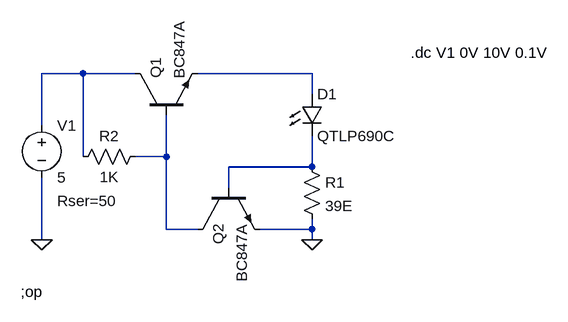
[diagram p0: schematic LEDdriver.asc]
LEDdriver.asc, the LTspice schematic file:
Version 4
SHEET 1 880 680
WIRE -64 112 -128 112
WIRE 16 112 -64 112
WIRE 288 112 112 112
WIRE 288 144 288 112
WIRE -128 192 -128 112
WIRE -64 240 -64 112
WIRE 64 240 64 176
WIRE 64 240 16 240
WIRE 288 256 288 208
WIRE 288 256 160 256
WIRE 160 288 160 256
WIRE 64 352 64 240
WIRE 112 352 64 352
WIRE 288 352 288 336
WIRE 288 352 208 352
WIRE -128 368 -128 272
WIRE 288 368 288 352
FLAG 288 368 0
FLAG -128 368 0
SYMBOL LED 272 144 R0
SYMATTR InstName D1
SYMATTR Value QTLP690C
SYMBOL npn2 16 176 R270
SYMATTR InstName Q1
SYMATTR Value BC847A
SYMBOL npn2 112 288 M90
SYMATTR InstName Q2
SYMATTR Value BC847A
SYMBOL res 272 240 R0
SYMATTR InstName R1
SYMATTR Value 39E
SYMBOL res 32 224 R90
WINDOW 0 0 56 VBottom 0
WINDOW 3 32 56 VTop 0
SYMATTR InstName R2
SYMATTR Value 1K
SYMBOL voltage -128 176 R0
WINDOW 123 0 0 Left 0
WINDOW 39 24 132 Left 0
SYMATTR SpiceLine Rser=50
SYMATTR InstName V1
SYMATTR Value 5
TEXT -160 448 Left 0 !;op
TEXT 440 80 Left 0 !.dc V1 0V 10V 0.1V

The netlist it stands for:
* LEDdriver.asc
D1 N002 N004 QTLP690C
Q1 N001 N003 N002 0 BC847A
Q2 N003 N004 0 0 BC847A
R1 N004 0 39E
R2 N003 N001 1K
V1 N001 0 5 Rser=50
.model D D
.lib standard.dio
.model NPN NPN
.model PNP PNP
.lib standard.bjt
;op
.dc V1 0V 10V 0.1V
.backanno
.end